# Altium project STM32F103_TX_v0.0.PrjPcb
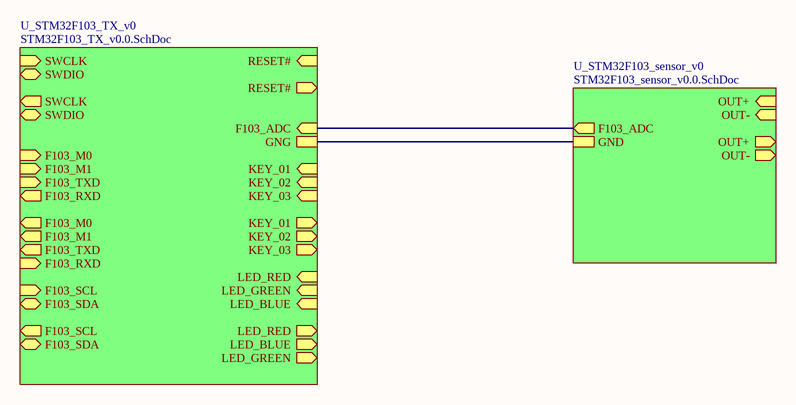
[diagram p0: STM32F103_top_v0.0.SchDoc]
3 sheets, 59 parts. Net scope: hierarchical (ports join the sheet entries above them; power ports are global).
Board file: STM32F103_TX_v0.0.PcbDoc
Sheets:
  STM32F103_top_v0.0.SchDoc
    U_STM32F103_sensor_v0 = STM32F103_sensor_v0.0.SchDoc
    U_STM32F103_TX_v0 = STM32F103_TX_v0.0.SchDoc

## Sheet STM32F103_top_v0.0.SchDoc
size A4

### Sub-sheets
U_STM32F103_sensor_v0 = STM32F103_sensor_v0.0.SchDoc: OUT+ (out), OUT- (out), OUT+ (in), OUT- (in), F103_ADC (out), GND
U_STM32F103_TX_v0 = STM32F103_TX_v0.0.SchDoc: F103_M1 (out), F103_M0 (out), F103_TXD (out), F103_RXD (in), F103_SCL (out), F103_SDA (bidir), LED_BLUE (out), LED_RED (out), LED_GREEN (out), KEY_01 (in), KEY_02 (in), KEY_03 (in), F103_ADC (in), RESET# (in), F103_M0 (in), F103_M1 (in), F103_TXD (in), F103_RXD (out), F103_SCL (in), F103_SDA (bidir), RESET# (out), KEY_01 (out), KEY_02 (out), KEY_03 (out), LED_BLUE (in), LED_RED (in), LED_GREEN (in), SWCLK (out), SWDIO (bidir), SWCLK (in), SWDIO (bidir), GNG

### Nets
GND: sheet U_STM32F103_sensor_v0/GND, sheet U_STM32F103_TX_v0/GNG
NetB_1: sheet U_STM32F103_TX_v0/LED_BLUE, sheet U_STM32F103_TX_v0/LED_BLUE
NetC_RESET_1: sheet U_STM32F103_TX_v0/RESET#, sheet U_STM32F103_TX_v0/RESET#
NetCKEY1_1: sheet U_STM32F103_TX_v0/KEY_01, sheet U_STM32F103_TX_v0/KEY_01
NetCKEY2_1: sheet U_STM32F103_TX_v0/KEY_02, sheet U_STM32F103_TX_v0/KEY_02
NetCKEY3_1: sheet U_STM32F103_TX_v0/KEY_03, sheet U_STM32F103_TX_v0/KEY_03
NetG_1: sheet U_STM32F103_TX_v0/LED_GREEN, sheet U_STM32F103_TX_v0/LED_GREEN
NetOLED12864_3: sheet U_STM32F103_TX_v0/F103_SCL, sheet U_STM32F103_TX_v0/F103_SCL
NetOLED12864_4: sheet U_STM32F103_TX_v0/F103_SDA, sheet U_STM32F103_TX_v0/F103_SDA
NetR15_2: sheet U_STM32F103_sensor_v0/F103_ADC, sheet U_STM32F103_TX_v0/F103_ADC
NetR_1: sheet U_STM32F103_TX_v0/LED_RED, sheet U_STM32F103_TX_v0/LED_RED
NetSTlink_5: sheet U_STM32F103_TX_v0/SWCLK, sheet U_STM32F103_TX_v0/SWCLK
NetSTlink_6: sheet U_STM32F103_TX_v0/SWDIO, sheet U_STM32F103_TX_v0/SWDIO
NetSTM32F103_14: sheet U_STM32F103_TX_v0/F103_M0, sheet U_STM32F103_TX_v0/F103_M0
NetSTM32F103_15: sheet U_STM32F103_TX_v0/F103_M1, sheet U_STM32F103_TX_v0/F103_M1
NetSTM32F103_30: sheet U_STM32F103_TX_v0/F103_TXD, sheet U_STM32F103_TX_v0/F103_TXD
NetSTM32F103_31: sheet U_STM32F103_TX_v0/F103_RXD, sheet U_STM32F103_TX_v0/F103_RXD
NetU002_2: sheet U_STM32F103_sensor_v0/OUT-, sheet U_STM32F103_sensor_v0/OUT-
NetU002_3: sheet U_STM32F103_sensor_v0/OUT+, sheet U_STM32F103_sensor_v0/OUT+

## Sheet STM32F103_sensor_v0.0.SchDoc
size A4
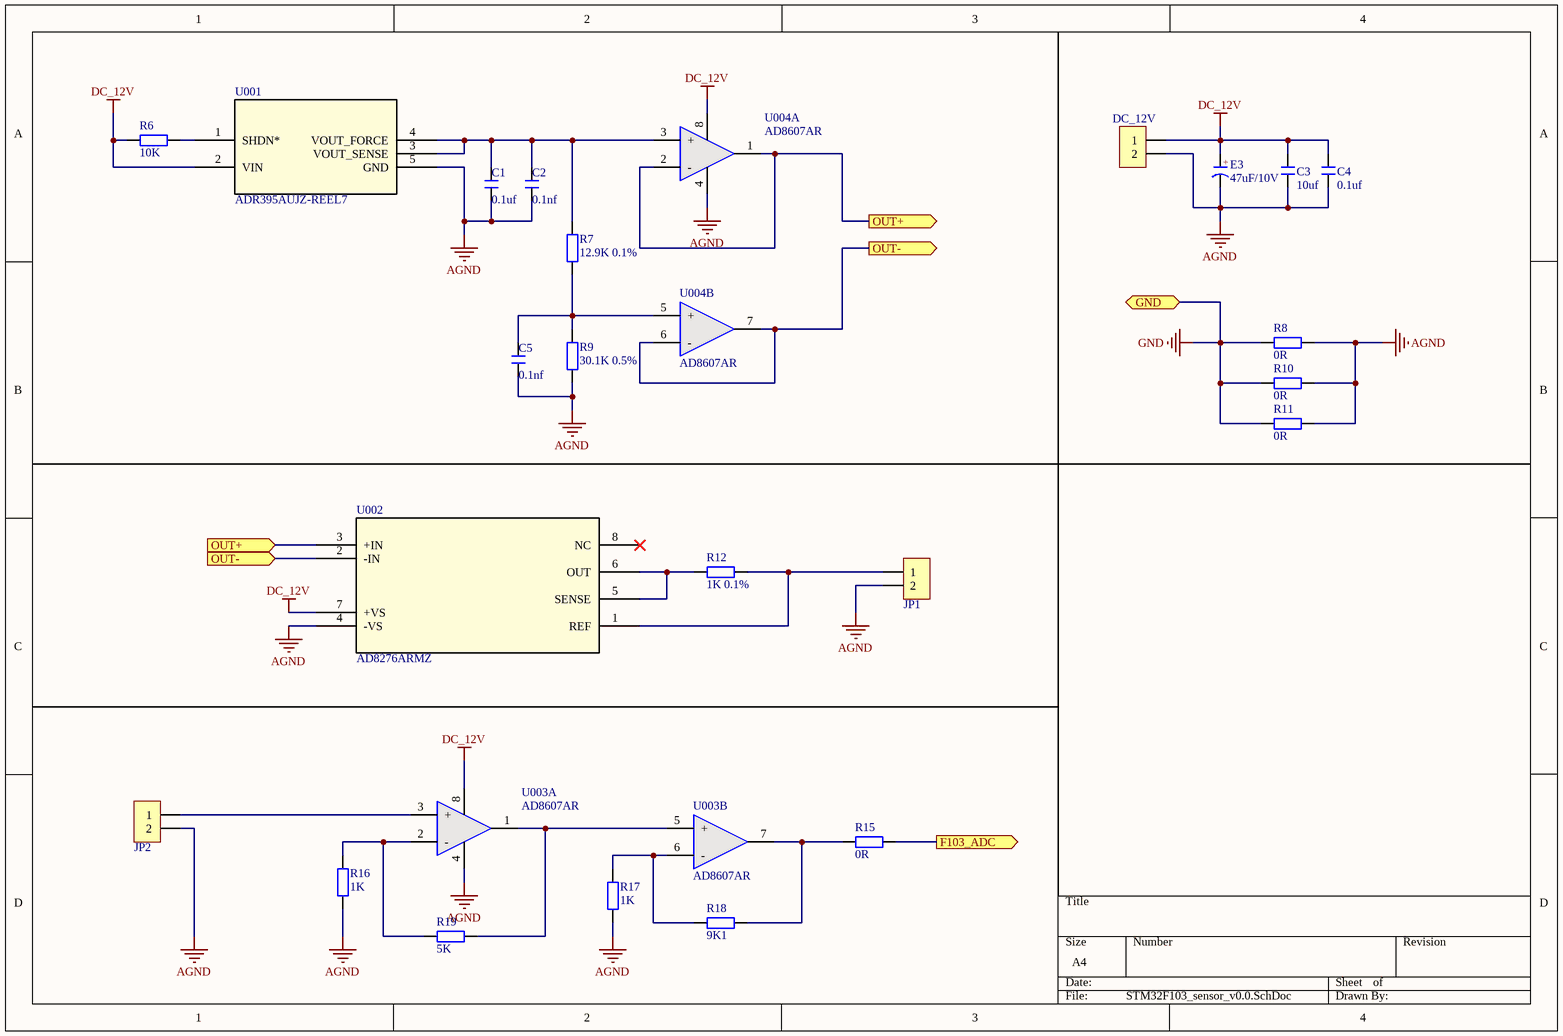
[diagram p1: STM32F103_sensor_v0.0.SchDoc]

### Parts
C1  0.1uf  [C 0603]
C2  0.1nf  [C 0603]
C3  10uf  [C 0603]
C4  0.1uf  [C 0603]
C5  0.1nf  [C 0603]
DC_12V  HDR-1X2  [HDR-1X2]  (value not drawn)
E3  47uF/10V  [CT 5*6 - C]
JP1  HDR-1X2  [HDR-1X2]  (value not drawn)
JP2  HDR-1X2  [HDR-1X2]  (value not drawn)
R6  10K  [R 0805]
R7  12.9K 0.1%  [R 0805]
R8  0R  [R 1206]
R9  30.1K 0.5%  [R 0805]
R10  0R  [R 1206]
R11  0R  [R 1206]
R12  1K 0.1%  [R 0805]
R15  0R  [R 0805]
R16  1K  [R 0805]
R17  1K  [R 0805]
R18  9K1  [R 0805]
R19  5K  [R 0805]
U001  ADR395AUJZ-REEL7  [SOT23-5L]
U002  AD8276ARMZ  [RM_8]
U003  AD8607AR  [SOP8_N]  (parts A,B of 2)
U004  AD8607AR  [SOP8_N]  (parts A,B of 2)

### Ports
F103_ADC (out), GND, OUT+ (in), OUT+ (out), OUT- (in), OUT- (out)

### Nets
AGND: C1.1 C2.1 C3.1 C4.1 C5.1 DC_12V.2 E3.2(K) JP1.2 JP2.2 R8.2 R9.2 R10.2 R11.2 R16.1 R17.1 U001.5(GND) U002.4(-VS) U003.4(V-) U004.4(V-)
DC_12V: C3.2 C4.2 DC_12V.1 E3.1(A) R6.2 U001.2(VIN) U002.7(+VS) U003.8(V+) U004.8(V+)
GND: R8.1 R10.1 R11.1 ; port GND
NetC1_2: C1.2 C2.2 R7.1 U001.3(VOUT_SENSE) U001.4(VOUT_FORCE) U004.3(+)
NetC5_2: C5.2 R7.2 R9.1 U004.5(+)
NetJP1_1: JP1.1 R12.2 U002.1(REF)
NetJP2_1: JP2.1 U003.3(+)
NetR6_1: R6.1 U001.1(SHDN*)
NetR12_1: R12.1 U002.5(SENSE) U002.6(OUT)
NetR15_1: R15.1 R18.1 U003.7(OUT2)
NetR15_2: R15.2 ; port F103_ADC
NetR16_2: R16.2 R19.2 U003.2(-)
NetR17_2: R17.2 R18.2 U003.6(-)
NetR19_1: R19.1 U003.1(OUT1) U003.5(+)
NetU002_2: U002.2(-IN) U004.6(-) U004.7(OUT2) ; port OUT-
NetU002_3: U002.3(+IN) U004.1(OUT1) U004.2(-) ; port OUT+

Not connected (* = marked no-connect by the designer): U002 8(NC)*

### Notes on the sheet
- (in symbol C-CT) +

### Library data of the parts
C1-C5 = C: 无极性贴片电容; 版权归属: 源创客; BOM名称: 无极性贴片电容; 学习资源: www.ooocke.com
DC_12V JP1 JP2 = Header 2: 2P接插件; 版权归属: 源创客; BOM名称: 2P接插件; 学习资源: www.ooocke.com
E3 = C-CT: 贴片固态电容; 版权归属: 源创客; BOM名称: 贴片固态电容; 学习资源: www.ooocke.com
R6-R12 R15-R19 = R: 贴片电阻; 版权归属: 源创客; BOM名称: 贴片电阻; 学习资源: www.ooocke.com
U003 U004 = AD8607AR: 双运放; 版权归属: 源创客; BOM名称: 双运放; 学习资源: www.ooocke.com

## Sheet STM32F103_TX_v0.0.SchDoc
size A4
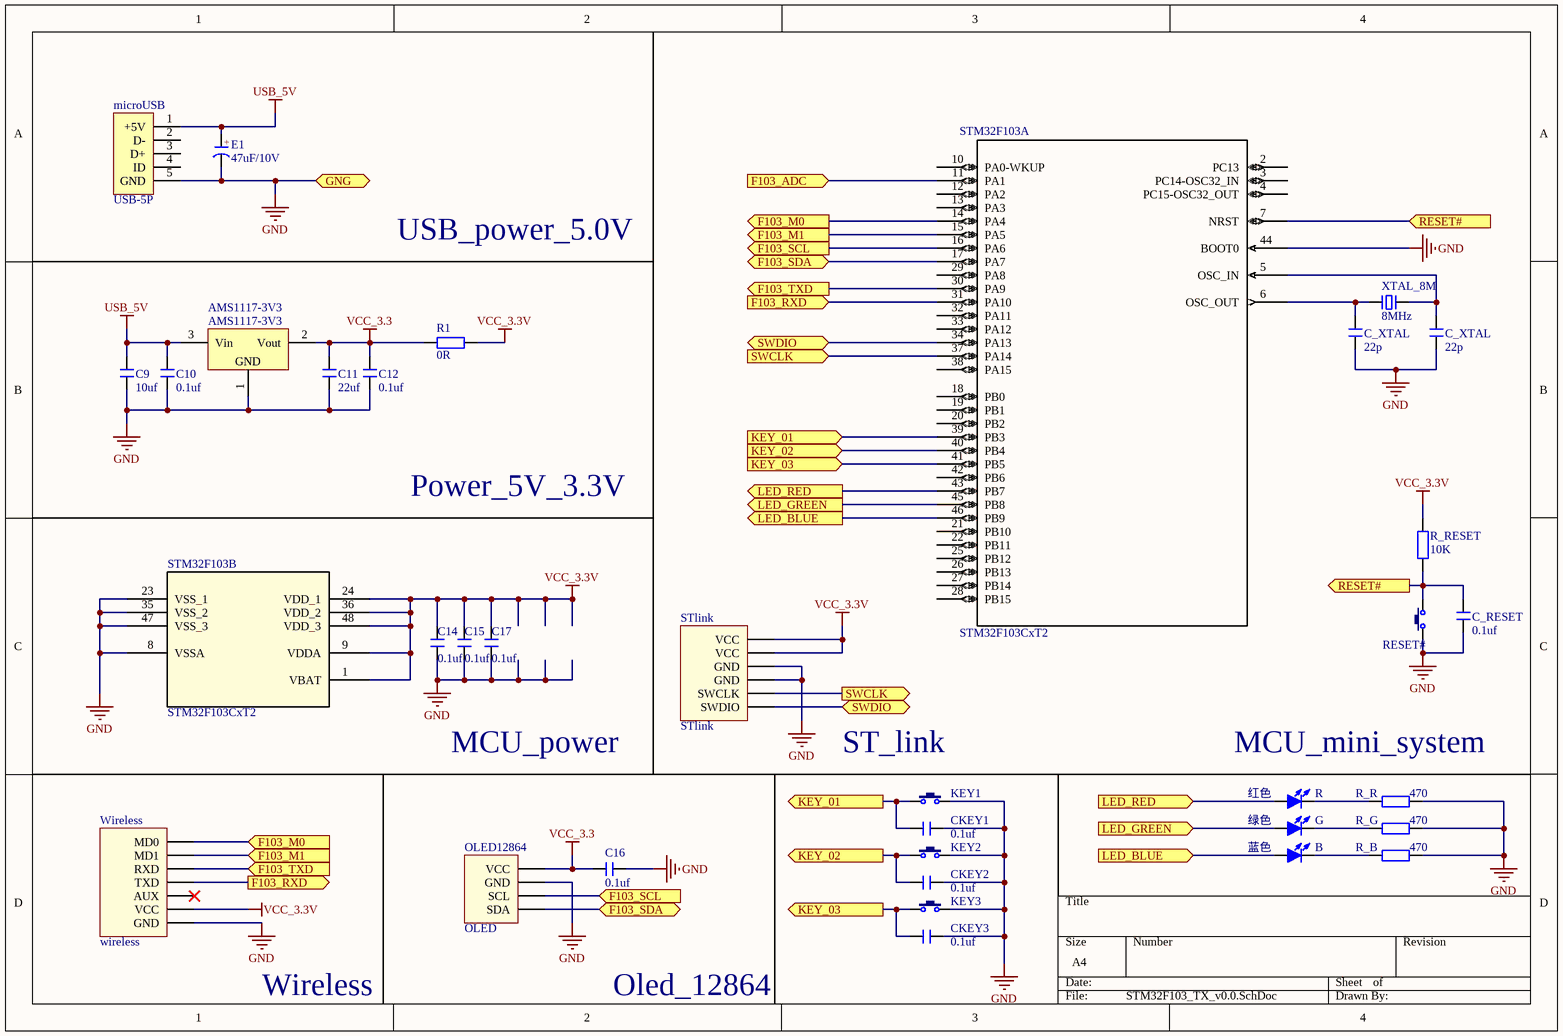
[diagram p2: STM32F103_TX_v0.0.SchDoc]

### Parts
(Parts that share a designator on the sheet are numbered #1, #2 ... from top to bottom, then left to right.)
AMS1117-3V3  AMS1117-3V3  [SOT223_L]
B  蓝色  [LED 0603B]
C9  10uf  [C 0603]
C10  0.1uf  [C 0603]
C11  22uf  [C 0603]
C12  0.1uf  [C 0603]
C14  0.1uf  [C 0603]
C15  0.1uf  [C 0603]
C16  0.1uf  [C 0603]
C17  0.1uf  [C 0603]
C_RESET  0.1uf  [C 0603]
C_XTAL#1  22p  [C 0603]
C_XTAL#2  22p  [C 0603]
CKEY1  0.1uf  [C 0603]
CKEY2  0.1uf  [C 0603]
CKEY3  0.1uf  [C 0603]
E1  47uF/10V  [CT 5*6 - C]
G  绿色  [LED 0603G]
KEY1  3x6x5  [TSW SMD-3*6*2.5]  (value not drawn)
KEY2  3x6x5  [TSW SMD-3*6*2.5]  (value not drawn)
KEY3  3x6x5  [TSW SMD-3*6*2.5]  (value not drawn)
microUSB  USB-5P  [USB-MICRO_B]
OLED12864  OLED  [HDR-1X4_M]
R  红色  [LED 0603R]
R1  0R  [R 0805]
R_B  470  [R 0805]
R_G  470  [R 0805]
R_R  470  [R 0805]
R_RESET  10K  [R 0805]
RESET#  3x6x5  [TSW SMD-3*6*2.5]  (value not drawn)
STlink  STlink  [IDC2.54-6P]
STM32F103  STM32F103CxT2  [LQFP48-7x7mm]  (parts A,B of 2)
Wireless  wireless  [HDR-1X7_M]
XTAL_8M  8MHz  [XTAL-49S DIP]

### Ports
F103_ADC (in), F103_M0 (in), F103_M0 (out), F103_M1 (in), F103_M1 (out), F103_RXD (in), F103_RXD (out), F103_SCL (in), F103_SCL (out), F103_SDA (bidir), F103_TXD (in), F103_TXD (out), GNG, KEY_01 (in), KEY_01 (out), KEY_02 (in), KEY_02 (out), KEY_03 (in), KEY_03 (out), LED_BLUE (in), LED_BLUE (out), LED_GREEN (in), LED_GREEN (out), LED_RED (in), LED_RED (out), RESET# (in), RESET# (out), SWCLK (in), SWCLK (out), SWDIO (bidir)

### Nets
GND: AMS1117-3V3.1(GND) C9.1 C10.1 C11.1 C12.1 C14.1 C15.1 C16.1 C17.1 C_RESET.2 C_XTAL#1.1 C_XTAL#2.1 CKEY1.2 CKEY2.2 CKEY3.2 E1.2(K) KEY1.2 KEY2.2 KEY3.2 microUSB.5(GND) OLED12864.2(GND) R_B.1 R_G.1 R_R.1 RESET#.1 STlink.3(GND) STlink.4(GND) STM32F103.8(VSSA) STM32F103.23(VSS_1) STM32F103.35(VSS_2) STM32F103.44(BOOT0) STM32F103.47(VSS_3) Wireless.7(GND) ; port GNG
USB_5V: AMS1117-3V3.3(Vin) C9.2 C10.2 E1.1(A) microUSB.1(+5V)
VCC_3.3: AMS1117-3V3.2(Vout) C11.2 C12.2 C16.2 OLED12864.1(VCC) R1.1
VCC_3.3V: C14.2 C15.2 C17.2 R1.2 R_RESET.2 STlink.1(VCC) STlink.2(VCC) STM32F103.1(VBAT) STM32F103.9(VDDA) STM32F103.24(VDD_1) STM32F103.36(VDD_2) STM32F103.48(VDD_3) Wireless.6(VCC)
NetB_1: B.1(A) STM32F103.46(PB9) ; port LED_BLUE
NetB_2: B.2(K) R_B.2
NetC_RESET_1: C_RESET.1 R_RESET.1 RESET#.2 STM32F103.7(NRST) ; port RESET#
NetC_XTAL#1_2: C_XTAL#1.2 STM32F103.6(OSC_OUT) XTAL_8M.1
NetC_XTAL#2_2: C_XTAL#2.2 STM32F103.5(OSC_IN) XTAL_8M.2
NetCKEY1_1: CKEY1.1 KEY1.1 STM32F103.39(PB3) ; port KEY_01
NetCKEY2_1: CKEY2.1 KEY2.1 STM32F103.40(PB4) ; port KEY_02
NetCKEY3_1: CKEY3.1 KEY3.1 STM32F103.41(PB5) ; port KEY_03
NetG_1: G.1(A) STM32F103.45(PB8) ; port LED_GREEN
NetG_2: G.2(K) R_G.2
NetOLED12864_3: OLED12864.3(SCL) STM32F103.16(PA6) ; port F103_SCL
NetOLED12864_4: OLED12864.4(SDA) STM32F103.17(PA7) ; port F103_SDA
NetR15_2: STM32F103.11(PA1) ; port F103_ADC
NetR_1: R.1(A) STM32F103.43(PB7) ; port LED_RED
NetR_2: R.2(K) R_R.2
NetSTlink_5: STlink.5(SWCLK) STM32F103.37(PA14) ; port SWCLK
NetSTlink_6: STlink.6(SWDIO) STM32F103.34(PA13) ; port SWDIO
NetSTM32F103_14: STM32F103.14(PA4) Wireless.1(MD0) ; port F103_M0
NetSTM32F103_15: STM32F103.15(PA5) Wireless.2(MD1) ; port F103_M1
NetSTM32F103_30: STM32F103.30(PA9) Wireless.3(RXD) ; port F103_TXD
NetSTM32F103_31: STM32F103.31(PA10) Wireless.4(TXD) ; port F103_RXD

Not connected (* = marked no-connect by the designer): microUSB 2(D-) 3(D+) 4(ID); STM32F103 2(PC13) 3(PC14-OSC32_IN) 4(PC15-OSC32_OUT) 10(PA0-WKUP) 12(PA2) 13(PA3) 18(PB0) 19(PB1) 20(PB2) 21(PB10) 22(PB11) 25(PB12) 26(PB13) 27(PB14) 28(PB15) 29(PA8) 32(PA11) 33(PA12) 38(PA15) 42(PB6); Wireless 5(AUX)*

### Notes on the sheet
- USB_power_5.0V
- Power_5V_3.3V
- MCU_power
- (near KEY1) ST_link
- MCU_mini_system
- Wireless
- Oled_12864
- (in symbol C-CT) +

### Library data of the parts
AMS1117-3V3 = AMS1117: 三端稳压芯片; BOM名称: 稳压芯片; 版权归属: 源创客; 学习资源: www.ooocke.com
B G R = LED-SMD: 贴片LED; 版权归属: 源创客; BOM名称: 贴片LED; 学习资源: www.ooocke.com
C9-C12 C14-C17 C_RESET C_XTAL#1 C_XTAL#2 CKEY1-CKEY3 = C: 无极性贴片电容; 版权归属: 源创客; BOM名称: 无极性贴片电容; 学习资源: www.ooocke.com
E1 = C-CT: 贴片固态电容; 版权归属: 源创客; BOM名称: 贴片固态电容; 学习资源: www.ooocke.com
KEY1-KEY3 RESET# = TSW 3x6: 3x6轻触开关; 版权归属: 源创客; BOM名称: 3x6轻触开关; 学习资源: www.ooocke.com
microUSB = USB-5P: 微型USB母座; 版权归属: 源创客; BOM名称: 微型USB母座; 学习资源: www.ooocke.com
R1 R_B R_G R_R R_RESET = R: 贴片电阻; 版权归属: 源创客; BOM名称: 贴片电阻; 学习资源: www.ooocke.com
STM32F103 = STM32F103CxT2: Imported; Vendor: STMicroelectronics; C: Copyright (C) 2016 Accelerated Designs. All rights reserved; Manufacturer_Part_Number: stm32f103cxt2; Copyright: Copyright (C) 2016 Accelerated Designs. All rights reserved; RefDes: RefDes; Type: Type; Value: Value
XTAL_8M = XTAL-2: 2脚晶振; 版权归属: 源创客; BOM名称: 2脚晶振; 学习资源: www.ooocke.com

## Nets that join several sheets
GND: STM32F103_sensor_v0.0 (R8.1 R10.1 R11.1), STM32F103_TX_v0.0 (33 pins)
NetR15_2: STM32F103_sensor_v0.0 (R15.2), STM32F103_TX_v0.0 (STM32F103.11)